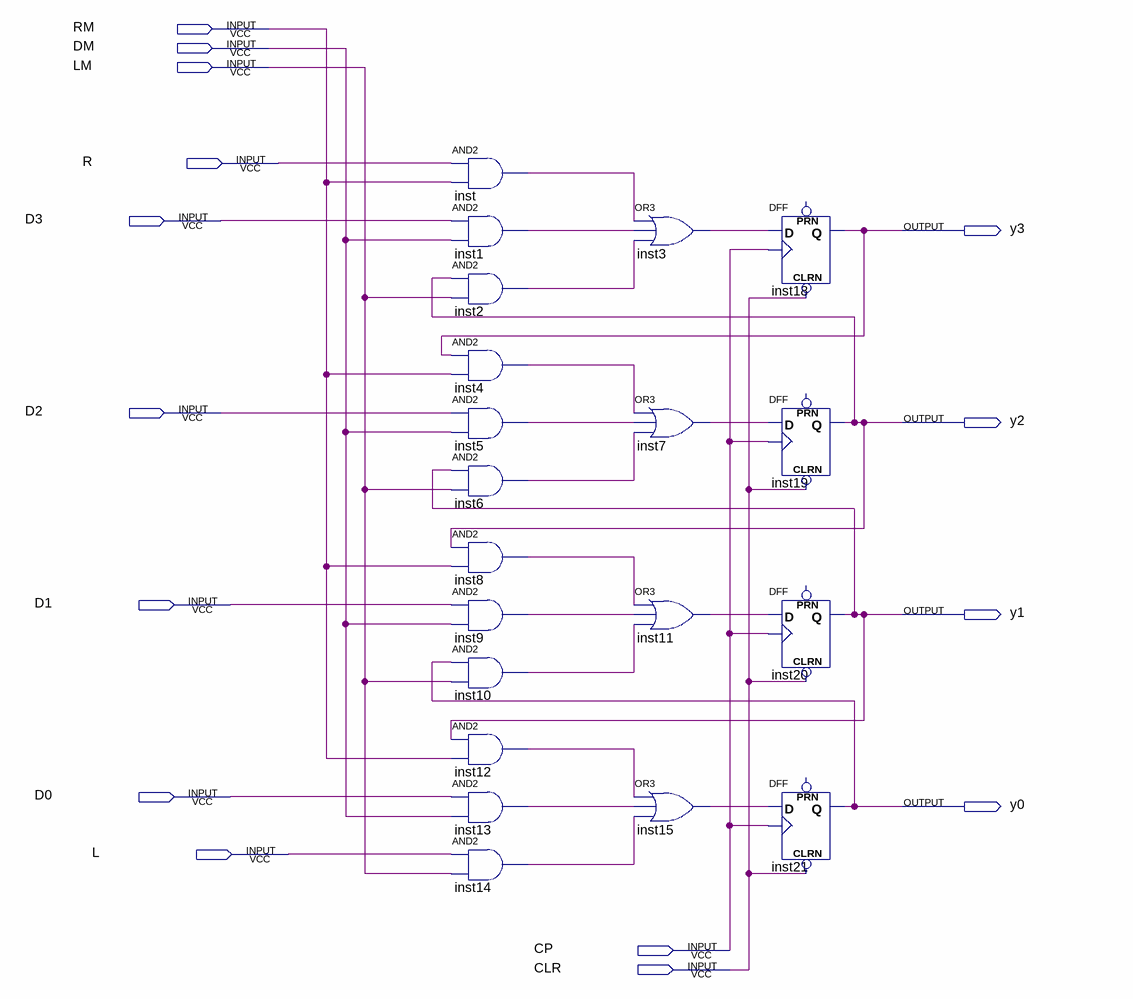
[diagram p0: schematic sheet]
// Quartus schematic 4yiweijicunqi.bdf as structural Verilog: 20 symbols, 15 pins
module \4yiweijicunqi  (
  input  RM,
  input  DM,
  input  LM,
  input  R,
  input  D3,
  input  D2,
  input  D1,
  input  D0,
  input  L,
  input  CP,
  input  CLR,
  output y3,
  output y2,
  output y1,
  output y0
);

  wire inst1_out, inst2_out, inst3_out, inst4_out, inst5_out, inst6_out, inst7_out, inst8_out, inst9_out,
       inst10_out, inst11_out, inst12_out, inst13_out, inst14_out, inst15_out, inst_out;

  and inst (inst_out, R, RM);
  and inst1 (inst1_out, D3, DM);
  and inst2 (inst2_out, y2, LM);
  and inst4 (inst4_out, y3, RM);
  and inst5 (inst5_out, D2, DM);
  and inst6 (inst6_out, y1, LM);
  and inst8 (inst8_out, y2, RM);
  and inst9 (inst9_out, D1, DM);
  and inst10 (inst10_out, y0, LM);
  and inst12 (inst12_out, y1, RM);
  and inst13 (inst13_out, D0, DM);
  and inst14 (inst14_out, L, LM);
  or inst3 (inst3_out, inst_out, inst1_out, inst2_out);
  or inst7 (inst7_out, inst4_out, inst5_out, inst6_out);
  or inst11 (inst11_out, inst8_out, inst9_out, inst10_out);
  or inst15 (inst15_out, inst12_out, inst13_out, inst14_out);
  DFF inst18 (.CLRN(CLR), .CLK(CP), .D(inst3_out), .Q(y3));  // open: PRN
  DFF inst19 (.CLRN(CLR), .CLK(CP), .D(inst7_out), .Q(y2));  // open: PRN
  DFF inst20 (.CLRN(CLR), .CLK(CP), .D(inst11_out), .Q(y1));  // open: PRN
  DFF inst21 (.CLRN(CLR), .CLK(CP), .D(inst15_out), .Q(y0));  // open: PRN
endmodule
